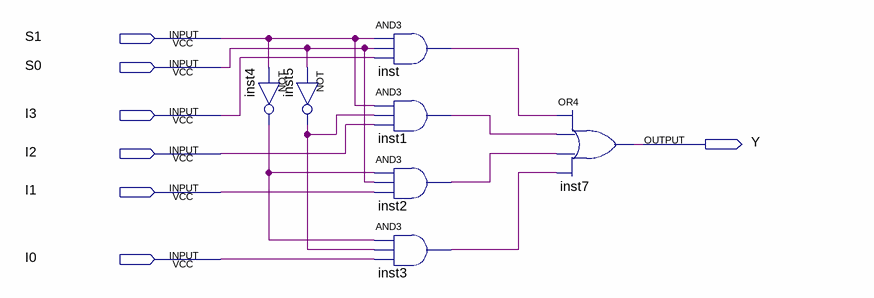
[diagram p0: schematic sheet]
// Quartus schematic mux.bdf as structural Verilog: 7 symbols, 7 pins
module mux (
  input  S1,
  input  S0,
  input  I3,
  input  I2,
  input  I1,
  input  I0,
  output Y
);

  wire inst1_out, inst2_out, inst3_out, inst4_out, inst5_out, inst_out;

  not inst4 (inst4_out, S1);
  not inst5 (inst5_out, S0);
  and inst (inst_out, S1, S0, I3);
  and inst1 (inst1_out, S1, inst5_out, I2);
  and inst2 (inst2_out, inst4_out, S0, I1);
  and inst3 (inst3_out, inst4_out, inst5_out, I0);
  or inst7 (Y, inst_out, inst1_out, inst2_out, inst3_out);
endmodule
